# Altium schematic sheet BOOT_SET.SchDoc
size A4
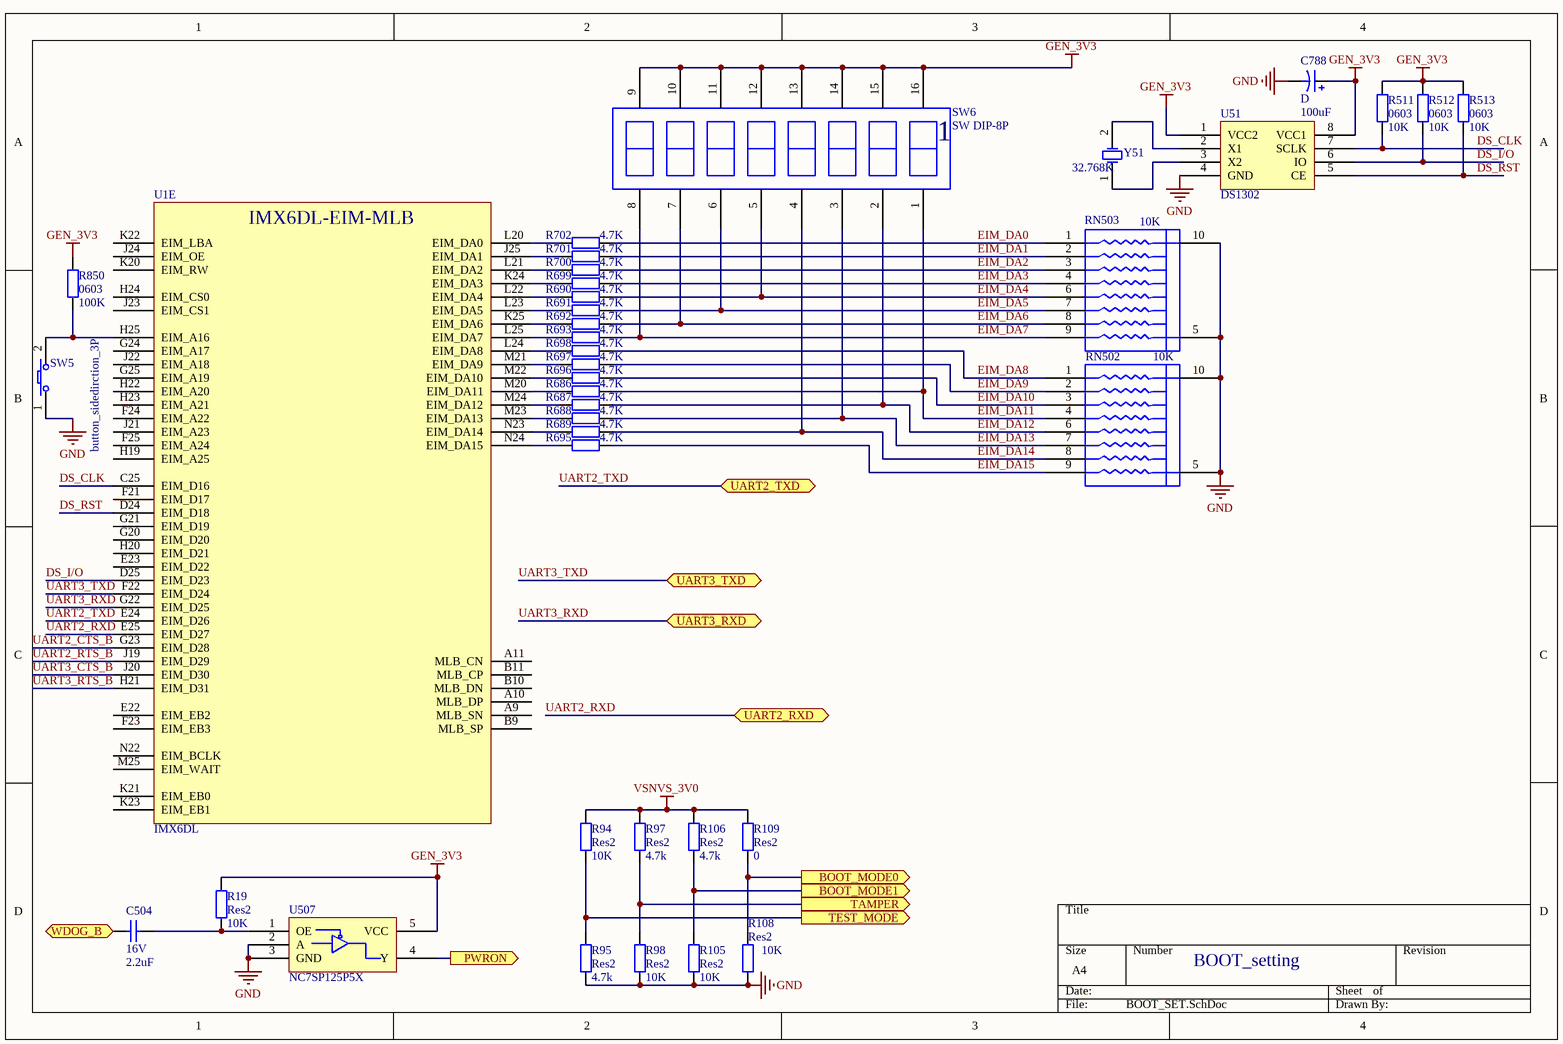
[diagram p0: BOOT_SET.SchDoc]

## Parts
C504  16V  value 2.2uF  [0603]
C788  D  value 100uF  [D]
R19  Res2  value 10K  [0402]
R94  Res2  value 10K  [0402]
R95  Res2  value 4.7k  [0402]
R97  Res2  value 4.7k  [0402]
R98  Res2  value 10K  [0402]
R105  Res2  value 10K  [0402]
R106  Res2  value 4.7k  [0402]
R108  Res2  value 10K  [0402]
R109  Res2  value 0  [0402]
R511  0603  value 10K  [0603]
R512  0603  value 10K  [0603]
R513  0603  value 10K  [0603]
R686  value 4.7K  [0402]  (hidden comment: Res2)
R687  value 4.7K  [0402]  (hidden comment: Res2)
R688  value 4.7K  [0402]  (hidden comment: Res2)
R689  value 4.7K  [0402]  (hidden comment: Res2)
R690  value 4.7K  [0402]  (hidden comment: Res2)
R691  value 4.7K  [0402]  (hidden comment: Res2)
R692  value 4.7K  [0402]  (hidden comment: Res2)
R693  value 4.7K  [0402]  (hidden comment: Res2)
R695  value 4.7K  [0402]  (hidden comment: Res2)
R696  value 4.7K  [0402]  (hidden comment: Res2)
R697  value 4.7K  [0402]  (hidden comment: Res2)
R698  value 4.7K  [0402]  (hidden comment: Res2)
R699  value 4.7K  [0402]  (hidden comment: Res2)
R700  value 4.7K  [0402]  (hidden comment: Res2)
R701  value 4.7K  [0402]  (hidden comment: Res2)
R702  value 4.7K  [0402]  (hidden comment: Res2)
R850  0603  value 100K  [0603]
RN502  10K  [RN_resistance -SMT8]
RN503  10K  [RN_resistance -SMT8]
SW5  button_sidedirction_3P  [button_sidedirction_3P 4.5X4.5]
SW6  SW DIP-8P  [dial switch -SMT DIP8]
U1  IMX6DL  [IMX6DL-BGA624x25]  (part E of 8)
U51  DS1302  [DS1302-DIP8]
U507  NC7SP125P5X  [NC7SP125P5X]
Y51  32.768K  [BCY-W2/D3.1]

## Ports
BOOT_MODE0 (out), BOOT_MODE1 (out), PWRON (out), TAMPER (out), TEST_MODE (out), UART2_RXD, UART2_TXD, UART3_RXD, UART3_TXD, WDOG_B (in)

## Nets
GEN_3V3: C788.1 R19.2 R511.2 R512.2 R513.2 R850.2 SW6.9 SW6.10 SW6.11 SW6.12 SW6.13 SW6.14 SW6.15 SW6.16 U51.1(VCC2) U51.8(VCC1) U507.5(VCC)
GND: C788.2 R95.1 R98.1 R105.1 R108.1 RN502.5 RN502.10 RN503.5 RN503.10 SW5.1 U51.4(GND) U507.2(A) U507.3(GND)
VSNVS_3V0: R94.2 R97.2 R106.2 R109.2
BOOT_MODE0: R108.2 R109.1 ; port BOOT_MODE0
BOOT_MODE1: R105.2 R106.1 ; port BOOT_MODE1
DS_CLK: R511.1 U1.C25(EIM_D16) U51.7(SCLK)
DS_I/O: R512.1 U1.D25(EIM_D23) U51.6(IO)
DS_RST: R513.1 U1.D24(EIM_D18) U51.5(CE)
EIM_DA0: R702.2 RN503.1
EIM_DA1: R701.2 RN503.2
EIM_DA2: R700.2 RN503.3
EIM_DA3: R699.2 RN503.4
EIM_DA4: R690.2 RN503.6 SW6.5(VDDUSB_CAP)
EIM_DA5: R691.2 RN503.7 SW6.6(VDDUSB_CAP)
EIM_DA6: R692.2 RN503.8 SW6.7(VDDUSB_CAP)
EIM_DA7: R693.2 RN503.9 SW6.8(VDDUSB_CAP)
EIM_DA8: R698.2 RN502.1
EIM_DA9: R697.2 RN502.2
EIM_DA10: R696.2 RN502.3
EIM_DA11: R686.2 RN502.4 SW6.1(VDDUSB_CAP)
EIM_DA12: R687.2 RN502.6 SW6.2(VDDUSB_CAP)
EIM_DA13: R688.2 RN502.7 SW6.3(VDDUSB_CAP)
EIM_DA14: R689.2 RN502.8 SW6.4(VDDUSB_CAP)
EIM_DA15: R695.2 RN502.9
PWRON: U507.4(Y) ; port PWRON
TAMPER: R97.1 R98.2 ; port TAMPER
TEST_MODE: R94.1 R95.2 ; port TEST_MODE
UART2_CTS_B: U1.G23(EIM_D28)
UART2_RTS_B: U1.J19(EIM_D29)
UART2_RXD: U1.E25(EIM_D27) ; port UART2_RXD
UART2_TXD: U1.E24(EIM_D26) ; port UART2_TXD
UART3_CTS_B: U1.J20(EIM_D30)
UART3_RTS_B: U1.H21(EIM_D31)
UART3_RXD: U1.G22(EIM_D25) ; port UART3_RXD
UART3_TXD: U1.F22(EIM_D24) ; port UART3_TXD
WDOG_B: C504.1 ; port WDOG_B
NetC504_2: C504.2 R19.1 U507.1(OE)
NetR686_1: R686.1 U1.M20(EIM_DA11)
NetR687_1: R687.1 U1.M24(EIM_DA12)
NetR688_1: R688.1 U1.M23(EIM_DA13)
NetR689_1: R689.1 U1.N23(EIM_DA14)
NetR690_1: R690.1 U1.L22(EIM_DA4)
NetR691_1: R691.1 U1.L23(EIM_DA5)
NetR692_1: R692.1 U1.K25(EIM_DA6)
NetR693_1: R693.1 U1.L25(EIM_DA7)
NetR695_1: R695.1 U1.N24(EIM_DA15)
NetR696_1: R696.1 U1.M22(EIM_DA10)
NetR697_1: R697.1 U1.M21(EIM_DA9)
NetR698_1: R698.1 U1.L24(EIM_DA8)
NetR699_1: R699.1 U1.K24(EIM_DA3)
NetR700_1: R700.1 U1.L21(EIM_DA2)
NetR701_1: R701.1 U1.J25(EIM_DA1)
NetR702_1: R702.1 U1.L20(EIM_DA0)
NetR850_1: R850.1 SW5.2 U1.H25(EIM_A16)
NetU51_2: U51.2(X1) Y51.2(OSC2)
NetU51_3: U51.3(X2) Y51.1(OSC1)

Not connected (* = marked no-connect by the designer): U1 A9(MLB_SN) A10(MLB_DP) A11(MLB_CN) B9(MLB_SP) B10(MLB_DN) B11(MLB_CP) E22(EIM_EB2) E23(EIM_D22) F21(EIM_D17) F23(EIM_EB3) F24(EIM_A22) F25(EIM_A24) G20(EIM_D20) G21(EIM_D19) G24(EIM_A17) G25(EIM_A19) H19(EIM_A25) H20(EIM_D21) H22(EIM_A20) H23(EIM_A21) H24(EIM_CS0) J21(EIM_A23) J22(EIM_A18) J23(EIM_CS1) J24(EIM_OE) K20(EIM_RW) K21(EIM_EB0) K22(EIM_LBA) K23(EIM_EB1) M25(EIM_WAIT) N22(EIM_BCLK)

## Notes on the sheet
- BOOT_setting
- (in symbol IMX6DL, part E) IMX6DL-EIM-MLB

## Library data of the parts
C504 = Cap: Capacitor; Published: 8-Jun-2000; LatestRevisionDate: 17-Jul-2002; LatestRevisionNote: Re-released for DXP Platform.; PackageReference: RAD-0.3; Publisher: Altium Limited
C788 = Cap Pol1: Polarized Capacitor (Radial); Published: 8-Jun-2000; LatestRevisionDate: 17-Jul-2002; LatestRevisionNote: Re-released for DXP Platform.; PackageReference: RB7.6-15; Publisher: Altium Limited
R19 R94 R95 R97 R98 R105 R106 R108 R109 R511-R513 R686-R693 R695-R702 R850 = Res2: Resistor; Published: 8-Jun-2000; LatestRevisionDate: 17-Jul-2002; LatestRevisionNote: Re-released for DXP Platform.; PackageReference: AXIAL-0.4; Publisher: Altium Limited
RN502 RN503 = RN res
SW6 = SW-8P
Y51 = XTAL: Crystal Oscillator; Published: 8-Jun-2000; LatestRevisionDate: 17-Jul-2002; LatestRevisionNote: Re-released for DXP Platform.; PackageReference: R38; Publisher: Altium Limited